# EAGLE schematic RNode (EAGLE 8.6.0)
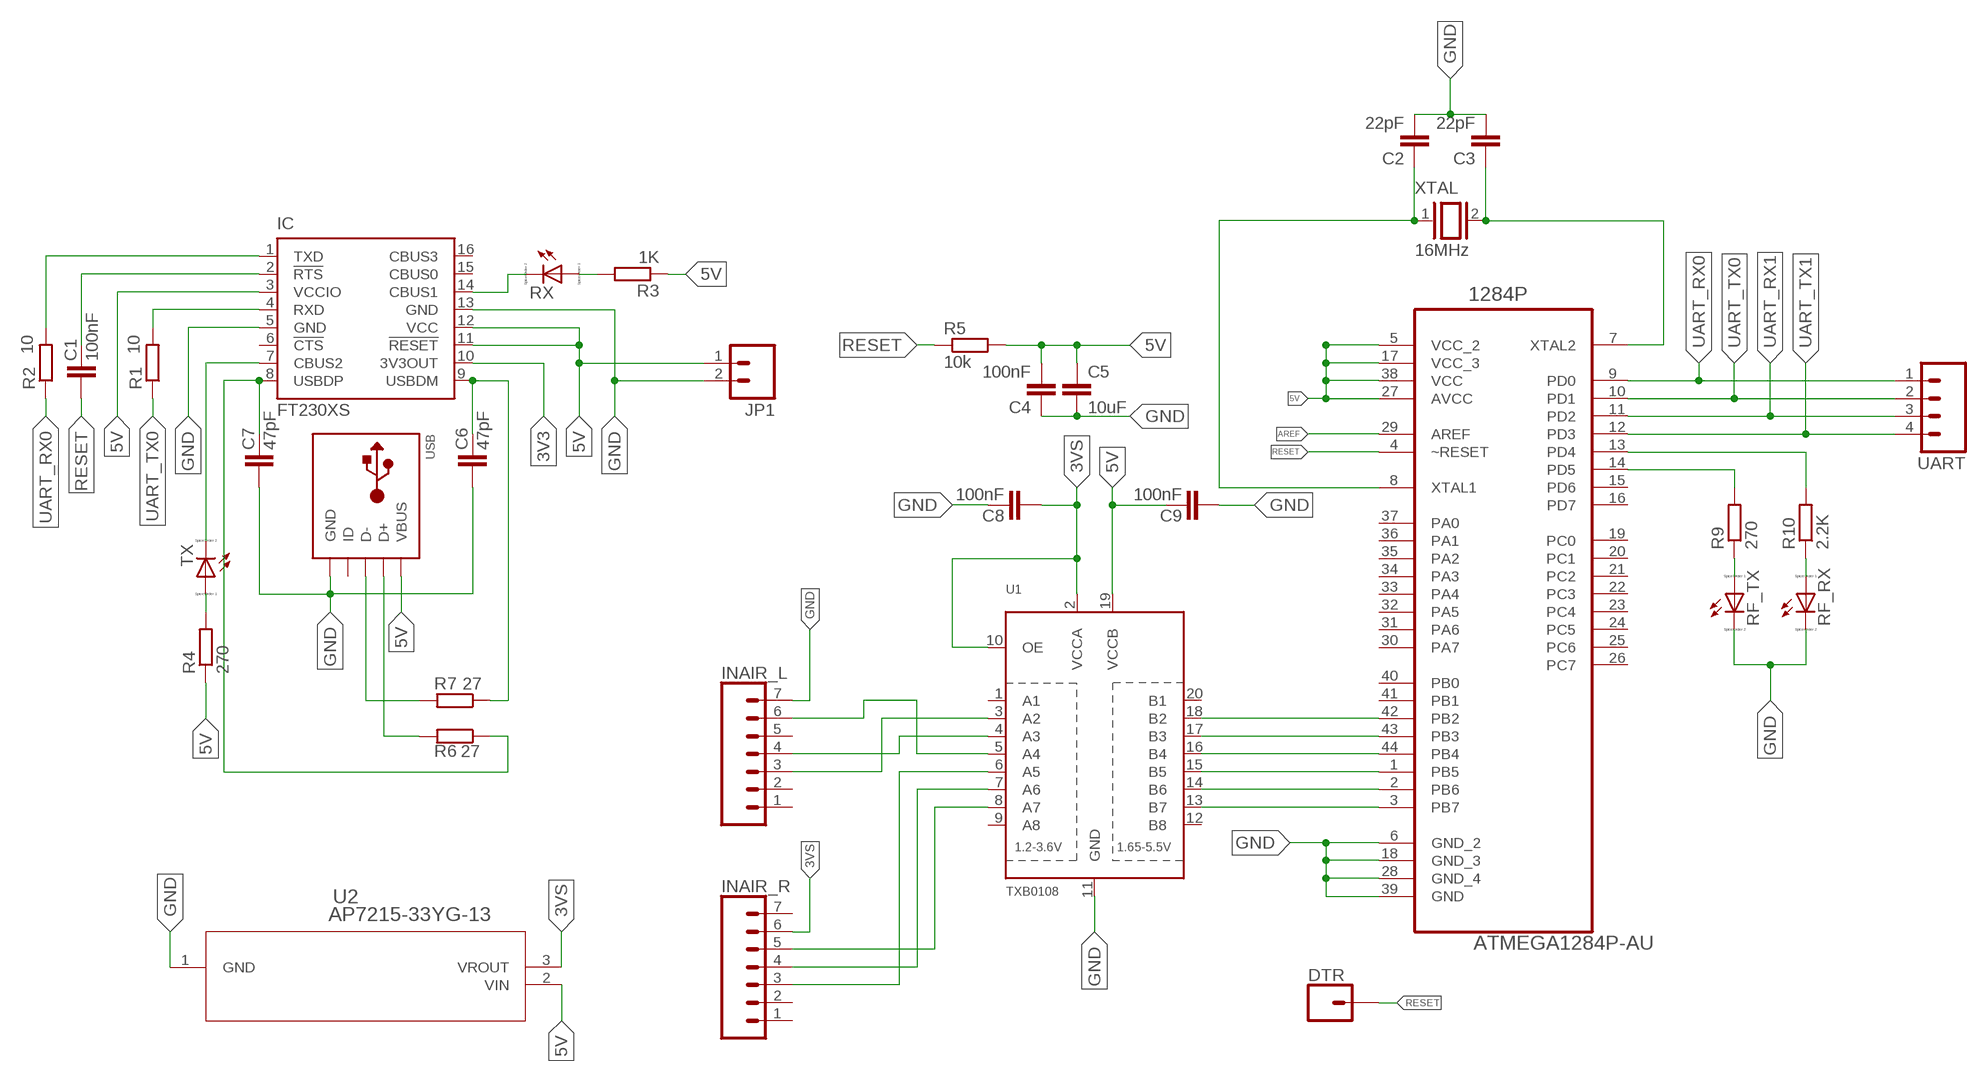
[diagram p0: schematic, sheet 1]

## Parts
1284P  ATMEGA1284P-AU  [QFP80P1200X1200X120-44N]
C1  100nF  C-EUC0603  [C0603]
C2  22pF  C-EUC0603  [C0603]
C3  22pF  C-EUC0603  [C0603]
C4  100nF  C-EUC0603  [C0603]
C5  10uF  C-EUC0805  [C0805]
C6  47pF  C-EUC0603  [C0603]
C7  47pF  C-EUC0603  [C0603]
C8  100nF  C-EUC0603  [C0603]
C9  100nF  C-EUC0603  [C0603]
DTR  CONN_01  [1X01]
IC  FT230XS  [SSOP16]
INAIR_L  CONN_07  [1X07]
INAIR_R  CONN_07  [1X07]
JP1  M02PTH  [1X02]
R1  10  R-EU_R0603  [R0603]
R2  10  R-EU_R0603  [R0603]
R3  1K  R-EU_R0603  [R0603]
R4  270  R-EU_R0603  [R0603]
R5  10k  R-EU_R0603  [R0603]
R6  27  R-EU_R0603  [R0603]
R7  27  R-EU_R0603  [R0603]
R9  270  R-EU_R0603  [R0603]
R10  2.2K  R-EU_R0603  [R0603]
RF_RX  LED_ESML0603  [LED_SML0603]
RF_TX  LED_ESML0603  [LED_SML0603]
RX  LED_ESML0603  [LED_SML0603]
TX  LED_ESML0603  [LED_SML0603]
U1  TXB0108  TXB0108PWR  [TSSOP20]
U2  AP7215-33YG-13  [SOT89-3L]
UART  M04PTH  [1X04]
USB  USBMOLEX  [USB-MINIB-THM-MOLEX]
XTAL  16MHz  XTAL/S  [QS]

## Nets
3V3: IC.10(3V3OUT)
3VS: C8.1 INAIR_R.6 U1.2(VCCA) U1.10(OE) U2.3(VROUT)
5V: 1284P.5(VCC_2) 1284P.17(VCC_3) 1284P.27(AVCC) 1284P.38(VCC) C4.2 C5.1 C9.2 IC.3(VCCIO) IC.11(!RESET) IC.12(VCC) JP1.1 R3.1 R4.1 R5.2 U1.19(VCCB) U2.2(VIN) USB.VBUS
AREF: 1284P.29(AREF)
CBUS1: IC.14(CBUS1) RX.C
CBUS2: IC.7(CBUS2) TX.C
GND: 1284P.6(GND_2) 1284P.18(GND_3) 1284P.28(GND_4) 1284P.39(GND) C2.2 C3.2 C4.1 C5.2 C6.1 C7.1 C8.2 C9.1 IC.5(GND) IC.13(GND) INAIR_L.7 JP1.2 RF_RX.C RF_TX.C U1.11(GND) U2.1(GND) USB.GND
N$2: R3.2 RX.A
N$3: R4.2 TX.A
N$5: C1.2 IC.2(!RTS)
NA3_CS: INAIR_L.6 U1.5(A4)
NA3_DI0: INAIR_L.3 U1.3(A2)
NA3_MISO: INAIR_R.4 U1.7(A6)
NA3_MOSI: INAIR_R.3 U1.6(A5)
NA3_RST: INAIR_L.4 U1.4(A3)
NA3_SCK: INAIR_R.5 U1.8(A7)
NA5_CS: 1284P.44(PB4) U1.16(B4)
NA5_DI0: 1284P.42(PB2) U1.18(B2)
NA5_MISO: 1284P.2(PB6) U1.14(B6)
NA5_MOSI: 1284P.1(PB5) U1.15(B5)
NA5_RST: 1284P.43(PB3) U1.17(B3)
NA5_SCK: 1284P.3(PB7) U1.13(B7)
RESET: 1284P.4(~RESET) C1.1 DTR.1 R5.1
RF_RX_LED: 1284P.13(PD4) R10.2
RF_RX_R: R10.1 RF_RX.A
RF_TX_LED: 1284P.14(PD5) R9.2
RF_TX_R: R9.1 RF_TX.A
UART_RX0: 1284P.9(PD0) R2.1 UART.1
UART_RX1: 1284P.11(PD2) UART.3
UART_TX0: 1284P.10(PD1) R1.1 UART.2
UART_TX1: 1284P.12(PD3) UART.4
USB_DM: C6.2 IC.9(USBDM) R7.1
USB_DM_IN: R7.2 USB.D-
USB_DP: C7.2 IC.8(USBDP) R6.1
USB_DP_IN: R6.2 USB.D+
USB_UART_RX: IC.4(RXD) R1.2
USB_UART_TX: IC.1(TXD) R2.2
XTAL1: 1284P.8(XTAL1) C2.1 XTAL.1
XTAL2: 1284P.7(XTAL2) C3.1 XTAL.2
Unconnected: 1284P.15(PD6) 1284P.16(PD7) 1284P.19(PC0) 1284P.20(PC1) 1284P.21(PC2) 1284P.22(PC3) 1284P.23(PC4) 1284P.24(PC5) 1284P.25(PC6) 1284P.26(PC7) 1284P.30(PA7) 1284P.31(PA6) 1284P.32(PA5) 1284P.33(PA4) 1284P.34(PA3) 1284P.35(PA2) 1284P.36(PA1) 1284P.37(PA0) 1284P.40(PB0) 1284P.41(PB1) IC.6(!CTS) IC.15(CBUS0) IC.16(CBUS3) INAIR_L.1 INAIR_L.2 INAIR_L.5 INAIR_R.1 INAIR_R.2 INAIR_R.7 U1.1(A1) U1.9(A8) U1.12(B8) U1.20(B1) USB.ID

## Library data of the parts
1284P = Atmel_By_element14_Batch_1-00:ATMEGA1284P-AU: Microcontroller with Programmable Flash; MPN: ATMEGA1284P-AU; OC_FARNELL: 1715480; OC_NEWARK: 15R0263; PACKAGE: TQFP-44; SUPPLIER: Atmel
C1-C9 = rcl:C-EU: CAPACITOR, European symbol
DTR = SparkFun-Connectors:CONN_01: Single connection point. Often used as Generic Header-pin footprint for 0.1 inch spaced/style header connections On any of the 0.1 inch spaced packages, you can populate with these: Break Away Headers - Straight <https://www.sparkfun.com/products/116> (PRT-00116) Break Away Male Headers - Right Angle <https://www.sparkfun.com/products/553> (PRT-00553) Female Headers <https://www.sparkfun.com/products/115> (PRT-00115) Break Away Headers - Machine Pin <https://www.sparkfun.com/products/117> (PRT-00117) Break Away Female Headers - Swiss Machine Pin <https://www.sparkfun.com/products/743> (PRT-00743) This device is also useful as a general connection point to wire up your design to another part of your project. Our various solder wires solder well into these plated through hole pads. Hook-Up Wire - Assortment (Stranded, 22 AWG) <https://www.sparkfun.com/products/11375> (PRT-11375) Hook-Up Wire - Assortment (Solid Core, 22 AWG) <https://www.sparkfun.com/products/11367> (PRT-11367) View the entire wire category on our website here <https://www.sparkfun.com/categories/141> Special notes: SMTSO-256-ET is a "flush mount" nut for a 4-40 screw. We mostly use this on specialty testbeds; it is a nice way to connect hardware to your PCB at an adjustable hieght. Also note, the SNAP packages are for using a snappable style connector. We sell a baggie of snaps and they are also used on two LilyPad designs: Snap Assortment - 30 pack (male and female) <https://www.sparkfun.com/products/11347> (DEV-11347) LilyPad Arduino SimpleSnap <https://www.sparkfun.com/products/10941> (DEV-10941) LilyPad SimpleSnap Protoboard <https://www.sparkfun.com/products/10940> (DEV-10940)
IC = ftdichip:FT230X: USB to BASIC UART IC Auto generated by make-symbol-device-package-bsdl.ulp Rev. 43 Source: Data sheet <http://www.ftdichip.com/Support/Documents/DataSheets/ICs/DS_FT230X.pdf>
INAIR_L INAIR_R = SparkFun-Connectors:CONN_07: Multi connection point. Often used as Generic Header-pin footprint for 0.1 inch spaced/style header connections On any of the 0.1 inch spaced packages, you can populate with these: Break Away Headers - Straight <https://www.sparkfun.com/products/116> (PRT-00116) Break Away Male Headers - Right Angle <https://www.sparkfun.com/products/553> (PRT-00553) Female Headers <https://www.sparkfun.com/products/115> (PRT-00115) Break Away Headers - Machine Pin <https://www.sparkfun.com/products/117> (PRT-00117) Break Away Female Headers - Swiss Machine Pin <https://www.sparkfun.com/products/743> (PRT-00743) For SCREWTERMINALS and SPRING TERMINALS visit here: Screw Terimnals on SparkFun.com <https://www.sparkfun.com/search/results?term=Screw+Terminals> (5mm/3.5mm/2.54mm spacing) This device is also useful as a general connection point to wire up your design to another part of your project. Our various solder wires solder well into these plated through hole pads. Hook-Up Wire - Assortment (Stranded, 22 AWG) <https://www.sparkfun.com/products/11375> (PRT-11375) Hook-Up Wire - Assortment (Solid Core, 22 AWG) <https://www.sparkfun.com/products/11367> (PRT-11367) View the entire wire category on our website here <https://www.sparkfun.com/categories/141> Special notes: Molex polarized connector foot print use with SKU : PRT-08231 with associated crimp pins and housings. 1MM SMD Version SKU: PRT-10208 NOTES ON THE VARIANTS LOCK and LOCK_LONGPADS... This footprint was designed to help hold the alignment of a through-hole component (i.e. 6-pin header) while soldering it into place. You may notice that each hole has been shifted either up or down by 0.005 of an inch from it's more standard position (which is a perfectly straight line). This slight alteration caused the pins (the squares in the middle) to touch the edges of the holes. Because they are alternating, it causes a "brace" to hold the component in place. 0.005 has proven to be the perfect amount of "off-center" position when using our standard breakaway headers. Although looks a little odd when you look at the bare footprint, once you have a header in there, the alteration is very hard to notice. Also,if you push a header all the way into place, it is covered up entirely on the bottom side.
JP1 = SparkFun-Connectors:M02: Standard 2-pin 0.1" header. Use with - straight break away headers ( PRT-00116) - right angle break away headers (PRT-00553) - swiss pins (PRT-00743) - machine pins (PRT-00117) - female headers (PRT-00115) Molex polarized connector foot print use with: PRT-08233 with associated crimp pins and housings. 2.54_SCREWTERM for use with PRT-10571. 3.5mm Screw Terminal footprints for PRT-08084 5mm Screw Terminal footprints for use with PRT-08432
R1-R7 R9 R10 = rcl:R-EU_: RESISTOR, European symbol
RF_RX RF_TX RX TX = eagle-ltspice:LED_E: LED Source: http://www.osram.convergy.de Source: www.luxeon.com Source: www.kingbright.com; SPICEMODEL: NONE; SPICEPREFIX: D; SPICETYPE: diode
U1 = adafruit:TXB0108PWR: 8-Bit Bi-Directional Level Shifter 1.2V-3.6V (VCCA) to 1.65V-5.5V (VCCB) bi-directional level shifter with auto direction sensing. Max data rate - VCCA 1.8V: 20Mbps (50ns), VCCA 3.3V: 100Mbps (10ns) Digikey: 296-21527-1-ND
U2 = AP7215-33YG:AP7215-33YG-13; MANUFACTURER_PART_NUMBER: AP721533YG13; VENDOR: Diodes Inc
UART = SparkFun-Connectors:M04: Header 4 Standard 4-pin 0.1" header. Use with straight break away headers (SKU : PRT-00116), right angle break away headers (PRT-00553), swiss pins (PRT-00743), machine pins (PRT-00117), and female headers (PRT-00115). Molex polarized connector foot print use with SKU : PRT-08231 with associated crimp pins and housings. 1MM SMD Version SKU: PRT-10208
USB = adafruit:USB: USB Connectors USBMINIB - Surface Mount Female Mini-B USB Connector 4UConnector: 06564 By microbuilder.eu Thru-hole RA Female Mini-B USB Connector 4UConnector: 18732 By ladyada.net
XTAL = special:XTAL/S: CRYSTAL